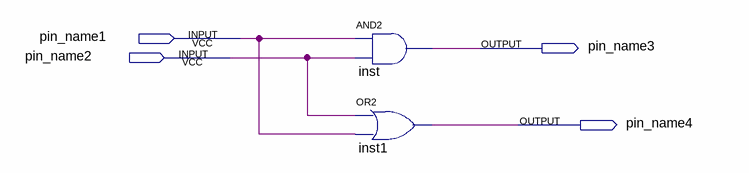
[diagram p0: schematic sheet]
// Quartus schematic test2.bdf as structural Verilog: 2 symbols, 4 pins
module test2 (
  input  pin_name1,
  input  pin_name2,
  output pin_name3,
  output pin_name4
);

  and inst (pin_name3, pin_name1, pin_name2);
  or inst1 (pin_name4, pin_name2, pin_name1);
endmodule
